# EasyEDA Pro project 新Exlink多功能调试器.epro, board 功率控制板
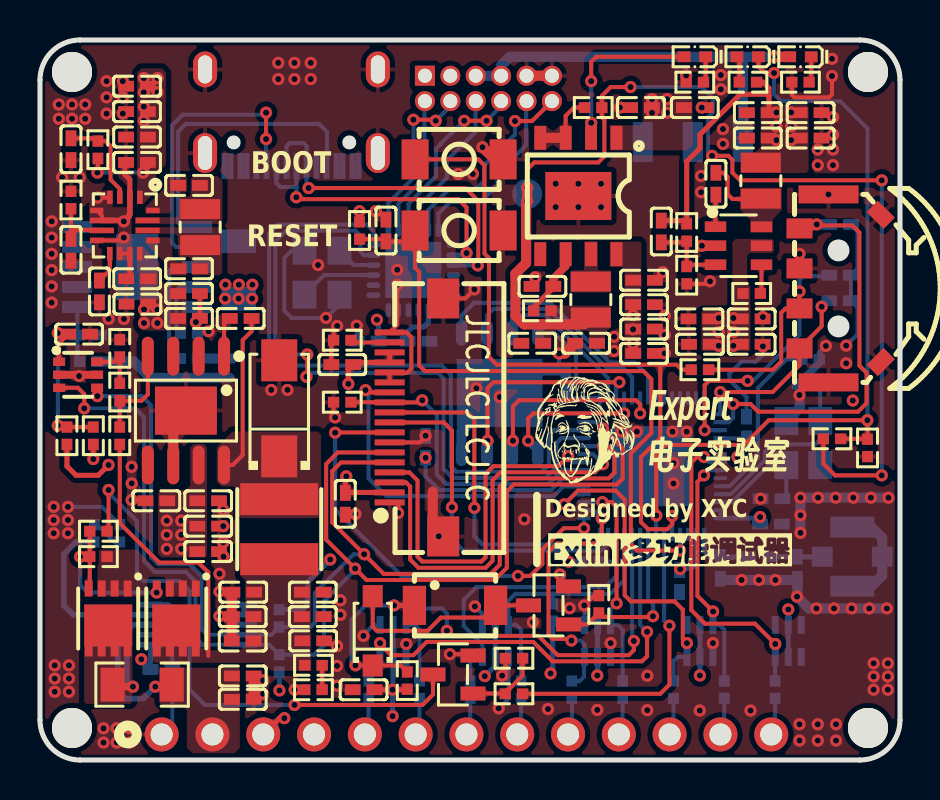
[diagram p6: board, top side]
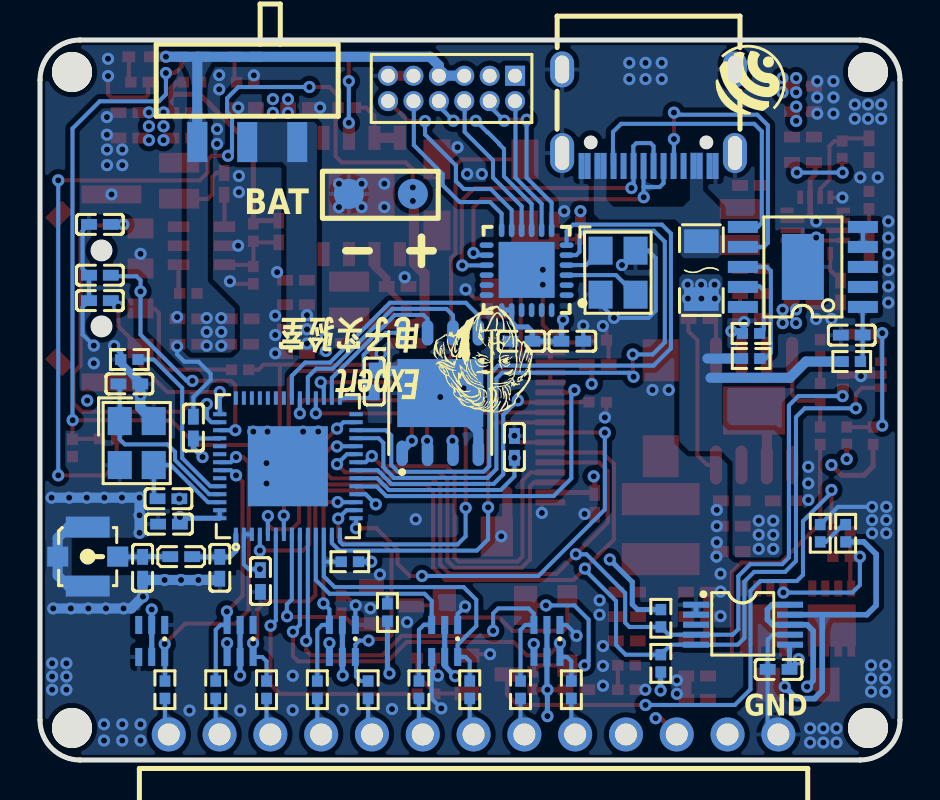
[diagram p7: board, bottom side, seen from below]

Outline 43 x 36 mm; copper layers: Top Layer, Inner1, Inner2, Bottom Layer. Coordinates in mm from the lower left corner of the outline.
Outline path: 0,34 0,2 arc(0.59,0.59) 2,0 41,0 arc(42.41,0.59) 43,2 43,34 arc(42.41,35.41) 41,36 2,36 arc(0.59,35.41) 0,34
Stack: Top Layer 0.035mm 外层铜厚1oz / Dielectric1 0.2104mm 7628 RC49% 8.6mil / Inner1 0.0152mm 内层铜厚 / Dielectric2 1.065mm 1.1mm H/HOZ Copper / Inner2 0.0152mm 内层铜厚 / Dielectric3 0.2104mm 7628 RC49% 8.6mil / Bottom Layer 0.035mm 外层铜厚1oz

## Design rules (mm)
template: 自定义配置
spacing copperThickness1oz (default): track to track 0.102, other pairs 0.152 to 0.175
spacing copperThickness2oz: track to track 0.203, other pairs 0.152 to 0.3
track width copperThickness1oz (default): min 0.127, default 0.203, max 2.54
track width power: min 0.203, default 0.254, max 2.54
differential pair differentialPair (default): width min 0.127, default 0.254, max 2.54; gap min 0.152, default 0.152
via viaSize (default): diameter min 0.5, default 0.61, max 10; hole min 0.3, default 0.305, max 6.299
net +5V uses power
net 3V3 uses power

## Placement (name value [footprint] x y rotation side)
BUZZER1  DET402  [BUZ-SMD_L4.0-W3.0-LS4.5-FD]  20.75 7.73 0 top
C1  1UF  [C0402]  17.3 26.47 270 top
C3  9PF  [C0402]  37.87 9.61 270 bottom
C4  9PF  [C0402]  34.01 9.61 270 bottom
C5  18pF  [C0402]  38.53 18.8 0 bottom
C6  18pF  [C0402]  36.58 13.06 180 bottom
C7  10uf  [C0402]  35.59 22.06 180 top
C8  100nF  [C0402]  31.98 8.95 270 bottom
C9  10uf  [C0402]  35.89 32.37 0 top
C10  100nF  [C0402]  36.55 11.79 180 bottom
C11  100nF  [C0402]  19.28 15.66 90 bottom
C12  100nF  [C0402]  35.33 16.62 90 bottom
C16  10UF  [C0402]  10.14 3.03 0 top
C17  10UF  [C0402]  10.14 4.2 0 top
C18  22uf  [C0402]  4.85 29.88 0 top
C19  10uf  [C0402]  4.85 31.15 0 top
C20  10uf  [C0402]  4.85 32.42 0 top
C21  10uf  [C0402]  4.85 33.69 0 top
C22  22nf  [C0402]  1.55 30.54 90 top
C23  1uf  [C0402]  2.97 23.43 90 top
C24  22nf  [C0402]  1.55 25.51 90 top
C25  10uf  [C0402]  4.86 24.06 180 top
C26  10uf  [C0402]  4.87 22.79 180 top
C27  10uf  [C0402]  7.45 23.32 0 top
C31  100nf  [C0402]  7.45 28.73 180 top
C32  100nf  [C0402]  7.45 24.56 180 top
C52  100nF  [C0402]  15.27 12.81 270 top
C53  100nF  [C0402]  15.11 19.77 0 top
C60  0.1UF  [C0402]  6.07 4.53 0 bottom
C65  100nF  [C0402]  18.92 20.94 0 bottom
C66  10uF  [C0402]  16.38 20.94 180 bottom
C69  10nF  [C0402]  10.03 22.08 0 top
C70  10uf  [C0402]  8.41 10.42 180 top
C75  100nF  [C0402]  10.13 7.17 0 top
C76  0.1uf  [C0402]  33.8 28.81 270 top
C77  47pf  [C0402]  31.06 26.42 90 top
C79  22uf  [C0402]  27.31 20.84 0 top
C80  10uf  [C0402]  8.41 11.69 180 top
C81  22uf  [C0402]  8.41 12.96 180 top
C82  10uf  [C0402]  10.16 8.39 0 top
C83  10uf  [C0402]  13.64 8.39 180 top
C87  22uf  [C0402]  25.12 23.68 0 top
C88  10uf  [C0402]  30.05 32.62 180 top
C89  22uf  [C0402]  32.74 32.62 0 top
C90  22uf  [C0402]  30.2 22.77 0 top
C91  22uf  [C0402]  30.2 23.99 0 top
C92  22uf  [C0402]  30.2 21.55 0 top
C94  10uf  [C0402]  2.41 21.24 0 bottom
C95  22uf  [C0402]  35.59 20.79 180 top
C96  10uf  [C0402]  35.89 31.1 0 top
C97  10uf  [C0402]  38.53 31.1 180 top
C98  22uf  [C0402]  10.13 5.95 0 top
C99  10uf  [C0402]  13.64 7.17 180 top
C100  22uf  [C0402]  13.66 5.96 180 top
C101  100nF  [C0402]  26.29 18.92 270 bottom
C102  22uf  [C0402]  38.53 32.37 180 top
C103  10uf  [C0402]  32.97 22.06 0 top
C104  10uf  [C0402]  32.99 20.79 0 top
C105  0.1uf  [C0402]  1.96 21.29 0 top
C106  22uf  [C0402]  7.45 22.08 0 top
C107  10uf  [C0402]  30.2 20.33 0 top
C108  22uf  [C0402]  5.82 12.96 0 top
C109  100nF  [C0402]  40 24.24 0 bottom
C110  100nF  [C0402]  40 26.78 0 bottom
C111  100nF  [C0402]  40 22.97 0 bottom
C112  100nF  [C0402]  16.18 3.51 180 top
C113  10uf  [C0402]  24.61 20.84 0 top
D1  1N4148W  [SOD-123F_L2.7-W1.6-LS3.8-RD]  16.64 6.46 90 top
H1  KH-2.54PH90-1X13P-L13.8  [HDR-TH_13P-P2.54-H-M-W10.4-N]  21.32 1.28 180 bottom
H2  DW127R-22-12-23  [HDR-TH_12P-P1.27-V-M-R2-C6-S1.27-1]  22.42 33.58 0 bottom
L1  15uH  [IND-SMD_L4.0-W4.0_FNR40XXS]  11.96 11.54 270 top
L4  1500R  [L0402]  35.94 10.17 180 bottom
LED3  -  [LED_0402]  35.38 35.16 180 top
LED7  -  [LED_0402]  32.74 35.16 180 top
LED8  -  [LED_0402]  38.02 35.16 180 top
NOREF  -  [Pad_e40]  1.6 34.4 0 top
NOREF#2  -  [Pad_e42]  41.4 1.6 0 top
NOREF#3  -  [Pad_e43]  41.4 34.4 0 top
NOREF#4  -  [Pad_e41]  1.6 1.6 0 top
R1  100K  [R0402]  38.53 20.02 0 bottom
R2  10K  [R0402]  15.98 26.47 90 top
R3  1M  [R0402]  13.67 4.73 180 top
R4  1M  [R0402]  13.67 3.51 0 top
R5  10K  [R0402]  2.92 10.17 180 top
R6  220R  [R0402]  2.92 11.44 0 top
R8  1M  [R0402]  2.72 11.34 270 bottom
R9  1M  [R0402]  3.99 11.34 270 bottom
R10  499K  [R0402]  2.89 30.52 90 top
R11  21.5k  [R0402]  1.55 28 270 top
R15  100K  [R0402]  35.59 23.33 180 top
R16  100K  [R0402]  32.33 26.37 90 top
R17  22.1k  [R0402]  32.33 24.24 90 top
R28  0.05  [R1206]  5.1 3.77 0 top
R29  10  [R0402]  15.11 20.99 0 top
R36  2K  [R0402]  35.4 33.89 180 top
R45  1K  [R0402]  27.66 32.62 0 top
R46  2K  [R0402]  32.74 33.89 180 top
R49  33Ω  [R0402]  16.43 3.51 270 bottom
R50  33Ω  [R0402]  18.97 3.51 270 bottom
R51  33Ω  [R0402]  21.51 3.51 270 bottom
R52  33Ω  [R0402]  24.05 3.51 270 bottom
R53  33Ω  [R0402]  26.59 3.51 270 bottom
R54  33Ω  [R0402]  29.13 3.51 270 bottom
R55  33Ω  [R0402]  31.67 3.51 270 bottom
R56  33Ω  [R0402]  34.21 3.51 270 bottom
R57  33Ω  [R0402]  36.75 3.51 270 bottom
R79  10K  [R0402]  3.99 16.21 90 top
R80  NC  [R0402]  3.99 20.58 90 top
R81  0.5  [R0402]  25.12 22.46 0 top
R85  10K  [R0402]  7.44 20.07 0 bottom
R86  24K  [R0402]  7.45 21.33 0 bottom
R87  1K  [R0402]  2.41 19.92 180 bottom
R88  10K  [R0402]  27.94 7.78 270 top
R89  5K  [R0402]  38.02 33.89 180 top
R90  0  [R0402]  15.11 17.89 180 top
R94  4.7K  [R0402]  11.96 7.09 90 bottom
R95  4.7K  [R0402]  11.96 4.83 270 bottom
R96  4.7K  [R0402]  25.63 7.37 270 bottom
R97  4.7K  [R0402]  27.51 9.91 180 bottom
R101  50  [R0402]  23.7 3.31 0 top
R102  10K  [R0402]  23.7 5.09 180 top
R103  0  [R0402]  3.99 18.4 90 top
R104  0  [R0402]  18.36 3.97 270 top
R105  0  [R0402]  2.67 16.21 90 top
R106  NC  [R0402]  1.35 16.21 90 top
R107  0  [R0402]  32.99 19.52 0 top
R108  20K  [R0402]  41.38 15.6 90 top
R109  20K  [R0402]  39.6 16.06 180 top
SW1  TM-2024A  [SW-SMD_TM-2024A]  40 23.58 270 top
SW3  SK-3245S-L1-A  [SW-SMD_SK-3245S-L1-A-1]  32.64 30.89 180 bottom
U1  ESP32-S3R8  [QFN-56_L7.0-W7.0-P0.40-TL-EP4.0]  30.61 14.69 90 bottom
U2  MP28167GQ-A  [QFN-16_L3.0-W3.0-P0.50_MP28167GQ-Z]  4.24 26.73 180 top
U4  SY8120B  [SOT-23-6_L2.9-W1.6-P0.95-LS2.8-BL]  34.93 25.71 270 top
U8  INA226AIDGST  [VSSOP-10_L3.0-W3.0-P0.50-LS4.9-BL]  7.85 6.77 270 bottom
U15  40MHz  [CRYSTAL-SMD_4P-L3.2-W2.5-BL]  38.16 15.85 270 bottom
U19  4.7uh  [IND-SMD_L2.5-W2.0_YXNAQ252010-3R3M]  8.01 26.65 90 top
U27  TC-S3403-2.0-260G  [SW-SMD_L4.0-W3.0-LS5.0]  20.96 26.47 0 top
U28  TC-S3403-2.0-260G  [SW-SMD_L4.0-W3.0-LS5.0]  20.96 30.03 180 top
U29  CH334F  [QFN-24_L4.0-W4.0-P0.50-BL-EP2.8]  18.67 24.49 90 bottom
U31  W25Q128JVPIQ  [WSON-8_L6.0-W5.0-P1.27-BL-EP]  22.99 18.35 180 bottom
U32  CH224K  [ESSOP-10_L4.9-W3.9-P1.0-LS6.0-TL-EP]  4.86 24.65 90 bottom
U51  TPS5450QDDARQ1  [SOIC-8_L4.9-W3.9-P1.27-LS6.0-BL-EP]  7.3 17.47 180 top
U52  SS54  [SMA_L4.2-W2.6-LS5.1-RD]  11.96 17.58 90 top
U53  4.7uh  [IND-SMD_L2.5-W2.0_YXNAQ252010-3R3M]  36.04 28.96 270 top
U66  1uh  [IND-SMD_L2.5-W2.0_YXNAQ252010-3R3M]  27.54 23.02 90 top
U68  IP5306  [ESOP-8_L4.9-W3.9-P1.27-LS6.0-BL-EP]  26.92 28.2 180 top
U69  MCP4017T-103E/LT  [SC-70-6_L2.2-W1.3-P0.65-LS2.1-BR]  1.91 19.26 180 top
U71  BAV99S  [SOT-363-6_L2.0-W1.3-P0.65-LS2.1-BL]  17.65 5.95 0 bottom
U82  JK-nSMD005/60V  [F1206]  9.93 24.49 270 bottom
U83  BAV99S  [SOT-363-6_L2.0-W1.3-P0.65-LS2.1-BL]  22.77 5.95 0 bottom
U84  BAV99S  [SOT-363-6_L2.0-W1.3-P0.65-LS2.1-BL]  27.88 5.95 0 bottom
U85  BAV99S  [SOT-363-6_L2.0-W1.3-P0.65-LS2.1-BL]  32.99 5.95 0 bottom
U86  BAV99S  [SOT-363-6_L2.0-W1.3-P0.65-LS2.1-BL]  37.41 5.95 0 bottom
U87  AO3400  [SOT-23-3_L2.9-W1.3-P1.90-LS2.4-BL-2]  20.65 4.28 90 top
U88  AO3400  [SOT-23-3_L2.9-W1.3-P1.90-LS2.4-BL-2]  25.43 7.73 90 top
U89  -  [电池接口]  24.36 28.3 0 bottom
U90  AON7403  [DFN-8_L3.0-W3.0-P0.65-BL]  6.81 7.07 180 top
U91  AON7403  [DFN-8_L3.0-W3.0-P0.65-BL]  3.41 7.07 180 top
U92  IPEX天线座  [IPEX-SMD_HC-RF-IPEX0303-01]  40.61 10.17 90 bottom
USB1  KH-TYPE-C-16P  [USB-C-SMD_KH-TYPE-C-16P]  12.57 32.11 0 bottom
X2  AFC01-S18FCA-00  [FPC-SMD_18P-P0.50_JS_AFC01-S18FCA-00]  18.82 17.13 90 top
X3  12MHz  [OSC-SMD_4P-L3.2-W2.5-BL]  14.1 24.37 270 bottom

## Footprints (pads in the part's own frame, mm; a bottom-side part is the same pattern mirrored in y, then rotated)
BUZ-SMD_L4.0-W3.0-LS4.5-FD
  rect 1.16x1.96 smd: 1(-2.03,0) 2(2.03,0)
C0402
  rect 0.79x0.54 smd: 1(-0.545,0) 2(0.545,0)
CRYSTAL-SMD_4P-L3.2-W2.5-BL
  rect 1.4x1.2 smd: 1(-1.1,-0.85) 2(1.1,-0.85) 3(1.1,0.85) 4(-1.1,0.85)
DFN-8_L3.0-W3.0-P0.65-BL
  rect 0.4x0.8 smd: 1(-0.975,-1.5) 2(-0.325,-1.5) 3(0.325,-1.5) 4(0.975,-1.5) 5(0.975,1.5) 6(0.325,1.5) 7(-0.325,1.5) 8(-0.975,1.5)
  rect 2.4x2.1 smd: 9(0,0.35)
ESOP-8_L4.9-W3.9-P1.27-LS6.0-BL-EP
  rect 0.6x1.2 smd: 1(-1.905,-2.909) 2(-0.635,-2.909) 3(0.635,-2.909) 4(1.905,-2.909) 5(1.905,2.909) 6(0.635,2.909) 7(-0.635,2.909) 8(-1.905,2.909)
  rect 3.3x2.4 smd: 9(0,0)
ESSOP-10_L4.9-W3.9-P1.0-LS6.0-TL-EP
  rect 0.6x1.5 smd: 1(-2,-3) 2(-1,-3) 3(0,-3) 4(1,-3) 5(2,-3) 6(2,3) 7(1,3) 8(0,3) 9(-1,3) 10(-2,3)
  rect 3.3x2.1 smd: 11(0,0)
F1206
  rect 1.19x1.728 smd: 1(-1.445,0) 2(1.445,0)
FPC-SMD_18P-P0.50_JS_AFC01-S18FCA-00
  rect 0.3x1.5 smd: 1(-4.25,1.339) 2(-3.751,1.339) 3(-3.25,1.339) 4(-2.749,1.339) 5(-2.249,1.339) 6(-1.749,1.339) 7(-1.248,1.339) 8(-0.75,1.339) 9(-0.251,1.339) 10(0.25,1.339) 11(0.75,1.339) 12(1.251,1.339) 13(1.751,1.339) 14(2.251,1.339) 15(2.751,1.339) 16(3.25,1.339) 17(3.75,1.339) 18(4.25,1.339)
  rect 2x1.6 smd: 19(5.949,-1.339) 20(-5.949,-1.339)
HDR-TH_12P-P1.27-V-M-R2-C6-S1.27-1
  rect 1x1 hole 0.7: 1(-3.175,-0.635)
  round 1 hole 0.7: 2(-3.175,0.635) 3(-1.905,-0.635) 4(-1.905,0.635) 5(-0.635,-0.635) 6(-0.635,0.635) 7(0.635,-0.635) 8(0.635,0.635) 9(1.905,-0.635) 10(1.905,0.635) 11(3.175,-0.635) 12(3.175,0.635)
HDR-TH_13P-P2.54-H-M-W10.4-N
  round 1.7 hole 1.1: 1(-15.24,0) 2(-12.7,0) 3(-10.16,0) 4(-7.62,0) 5(-5.08,0) 6(-2.54,0) 7(0,0) 8(2.54,0) 9(5.08,0) 10(7.62,0) 11(10.16,0) 12(12.7,0) 13(15.24,0)
IND-SMD_L2.5-W2.0_YXNAQ252010-3R3M
  rect 1x2 smd: 1(0.9,0) 2(-0.9,0)
IND-SMD_L4.0-W4.0_FNR40XXS
  rect 1.6x3.9 smd: 1(-1.5,0) 2(1.5,0)
IPEX-SMD_HC-RF-IPEX0303-01
  rect 1x1.05 smd: 1(0,-1.5) 4(0,1.5)
  rect 1.05x2.2 smd: 2(1.475,0) 3(-1.475,0)
L0402
  rect 0.79x0.54 smd: 1(-0.545,0) 2(0.545,0)
LED_0402
  rect 0.637x0.541 smd: 1(-0.538,0) 2(0.538,0)
OSC-SMD_4P-L3.2-W2.5-BL
  rect 1.4x1.2 smd: 1(-1.1,-0.875) 2(1.1,-0.875) 3(1.1,0.875) 4(-1.1,0.875)
Pad_e40
  round 2 hole 2: 58(0,0)
Pad_e41
  round 2 hole 2: 58(0,0)
Pad_e42
  round 2 hole 2: 58(0,0)
Pad_e43
  round 2 hole 2: 58(0,0)
QFN-16_L3.0-W3.0-P0.50_MP28167GQ-Z
  rect 0.28x0.665 smd: 1(-0.75,-1.407) 2(-0.25,-1.407) 3(0.25,-1.407) 4(0.75,-1.407) 9(0.75,1.407) 10(0.25,1.407) 11(-0.25,1.407) 12(-0.75,1.407)
  rect 0.665x0.28 smd: 5(1.407,-0.75) 8(1.407,0.75) 13(-1.407,0.75) 16(-1.407,-0.75)
  rect 1.2x0.28 smd: 6(1.14,-0.25) 7(1.14,0.25) 14(-1.14,0.25) 15(-1.14,-0.25)
QFN-24_L4.0-W4.0-P0.50-BL-EP2.8
  oval 0.28x0.7 smd: 1(-1.25,-2) 2(-0.75,-2) 3(-0.25,-2) 4(0.25,-2) 5(0.75,-2) 6(1.25,-2) 13(1.25,2) 14(0.75,2) 15(0.25,2) 16(-0.25,2) 17(-0.75,2) 18(-1.25,2)
  oval 0.7x0.28 smd: 7(2,-1.25) 8(2,-0.75) 9(2,-0.25) 10(2,0.25) 11(2,0.75) 12(2,1.25) 19(-2,1.25) 20(-2,0.75) 21(-2,0.25) 22(-2,-0.25) 23(-2,-0.75) 24(-2,-1.25)
  rect 2.8x2.8 smd: 25(0.013,0)
QFN-56_L7.0-W7.0-P0.40-TL-EP4.0
  rect 0.665x0.2 smd: 1(-3.408,2.6) 2(-3.408,2.2) 3(-3.408,1.8) 4(-3.408,1.4) 5(-3.408,1) 6(-3.408,0.6) 7(-3.408,0.2) 8(-3.408,-0.2) 9(-3.408,-0.6) 10(-3.408,-1) 11(-3.408,-1.4) 12(-3.408,-1.8) 13(-3.408,-2.2) 14(-3.408,-2.6) 29(3.408,-2.6) 30(3.408,-2.2) 31(3.408,-1.8) 32(3.408,-1.4) 33(3.408,-1) 34(3.408,-0.6) 35(3.408,-0.2) 36(3.408,0.2) 37(3.408,0.6) 38(3.408,1) 39(3.408,1.4) 40(3.408,1.8) 41(3.408,2.2) 42(3.408,2.6)
  rect 0.2x0.665 smd: 15(-2.6,-3.408) 16(-2.2,-3.408) 17(-1.8,-3.408) 18(-1.4,-3.408) 19(-1,-3.408) 20(-0.6,-3.408) 21(-0.2,-3.408) 22(0.2,-3.408) 23(0.6,-3.408) 24(1,-3.408) 25(1.4,-3.408) 26(1.8,-3.408) 27(2.2,-3.408) 28(2.6,-3.408) 43(2.6,3.408) 44(2.2,3.408) 45(1.8,3.408) 46(1.4,3.408) 47(1,3.408) 48(0.6,3.408) 49(0.2,3.408) 50(-0.2,3.408) 51(-0.6,3.408) 52(-1,3.408) 53(-1.4,3.408) 54(-1.8,3.408) 55(-2.2,3.408) 56(-2.6,3.408)
  rect 4x4 smd: 57(0,0)
R0402
  rect 0.566x0.54 smd: 1(-0.433,0) 2(0.433,0)
R1206
  rect 1.208x1.701 smd: 1(-1.479,0) 2(1.479,0)
SC-70-6_L2.2-W1.3-P0.65-LS2.1-BR
  rect 0.6x0.42 smd: 1(0.95,-0.65) 2(0.95,0) 3(0.95,0.65) 4(-0.95,0.65) 5(-0.95,0) 6(-0.95,-0.65)
SMA_L4.2-W2.6-LS5.1-RD
  rect 2.1x1.8 smd: 1(-2.4,0) 2(2.4,0)
SOD-123F_L2.7-W1.6-LS3.8-RD
  rect 1.1x1 smd: 1(-1.735,0) 2(1.735,0)
SOIC-8_L4.9-W3.9-P1.27-LS6.0-BL-EP
  oval 0.602x1.941 smd: 1(-1.905,-2.72) 2(-0.635,-2.72) 3(0.635,-2.72) 4(1.905,-2.72) 5(1.905,2.72) 6(0.635,2.72) 7(-0.635,2.72) 8(-1.905,2.72)
  rect 3.098x2.41 smd: 9(0,0)
SOT-23-3_L2.9-W1.3-P1.90-LS2.4-BL-2
  rect 0.7x1.25 smd: 1(-0.95,-1) 2(0.95,-1) 3(0,1)
SOT-23-6_L2.9-W1.6-P0.95-LS2.8-BL
  rect 0.532x1.072 smd: 1(-0.95,-1.149) 2(0,-1.149) 3(0.95,-1.149) 4(0.95,1.149) 5(0,1.149) 6(-0.95,1.149)
SOT-363-6_L2.0-W1.3-P0.65-LS2.1-BL
  rect 0.35x0.9 smd: 1(-0.65,-0.8) 2(0,-0.8) 3(0.65,-0.8) 4(0.65,0.8) 5(0,0.8) 6(-0.65,0.8)
SW-SMD_L4.0-W3.0-LS5.0
  rect 1.35x2 smd: 1(-2.2,0) 2(2.2,0)
SW-SMD_SK-3245S-L1-A-1
  rect 1x2 smd: 1(-2.5,0) 2(0,0) 3(2.5,0)
SW-SMD_TM-2024A
  rect 1x1.3 smd: 1(-3,-2.03) 2(3,-2.03) 3(-1,-2.03) 4(1,-2.03)
  rect 0.9x3 smd: 5(-4.7,-0.58) 6(4.7,-0.58)
  rect 1.2x0.8 smd rot 45: 7(-3.68,2.03)
  rect 1.2x0.8 smd rot 135: 8(3.68,2.03)
USB-C-SMD_KH-TYPE-C-16P
  oval 1.2x2 hole 0.7x1.7: 1(-4.32,1.765) 2(4.32,1.765)
  oval 1.2x1.8 hole 0.7x1.4: 3(-4.32,-2.415) 4(4.32,-2.415)
  rect 0.3x1.3 smd: A1(-3.35,2.415) A4(-2.55,2.415) A5(-1.25,2.415) A6(-0.25,2.415) A7(0.25,2.415) A8(1.25,2.415) A9(2.55,2.415) A12(3.35,2.415) B1(3.05,2.415) B4(2.25,2.415) B5(1.75,2.415) B6(0.75,2.415) B7(-0.75,2.415) B8(-1.75,2.415) B9(-2.25,2.415) B12(-3.05,2.415)
VSSOP-10_L3.0-W3.0-P0.50-LS4.9-BL
  rect 0.3x1.3 smd: 1(-1,-2.35) 2(-0.5,-2.35) 3(0,-2.35) 4(0.5,-2.35) 5(1,-2.35) 6(1,2.35) 7(0.5,2.35) 8(0,2.35) 9(-0.5,2.35) 10(-1,2.35)
WSON-8_L6.0-W5.0-P1.27-BL-EP
  oval 0.581x1.276 smd: 1(-1.905,-3.013) 2(-0.635,-3.013) 3(0.635,-3.013) 4(1.905,-3.013) 5(1.905,3.013) 6(0.635,3.013) 7(-0.635,3.013) 8(-1.905,3.013)
  rect 4.3x3.4 smd: 9(0,0)
电池接口
  round 1.5 smd: 1(0,0) 2(3.2,0)

## Nets
As in the schematic.

Pads without a net: NOREF 58; NOREF#2 58; NOREF#3 58; NOREF#4 58; U1 28 36 37 38 39 40 41 42 47 48 51; U8 3; U29 1 2 13 16 17 18 21 22 23 24; U32 2 3 10; U51 2 3 5; U68 5; U86 3; USB1 A8 B8

## Via types
v1: diameter 0.61, hole 0.305, Top Layer to Bottom Layer, 333 vias

## Routing (per net, layer and track width the routed paths; a pad name or vN(x,y) marks a point on that pad's centre or on a via; arc(x,y) is an arc through that point)
3V3: length 72.6
  Top Layer w0.254: 36.45,33.17 36.45,33.59 36.14,33.89 R36.1 ; 36.45,33.17 36.33,33.28 35.01,33.28 32.99,31.27 32.99,30.59 32.33,29.93 R16.2 32.17,26.97 C77.2 ; 36.45,33.17 36.45,32.38 C9.2 ; C112.1 v1(17.63,3.51) 18.34,3.51 R104.2 ; H1.11 11.97,2.09 v1(12.22,2.09) ; R105.1 v1(2.67,15.05) ; R2.2 v1(15.98,27.44) ; v1(15.32,14.18) 15.27,14.13 C52.1 15.29,13.38 X2.2 ; v1(15.42,18.8) 15.42,19.53 C53.2 15.77,19.88 X2.15 X2.16
  Inner1 w0.508: H2.1 H2.3
  Bottom Layer w0.203: C12.1 34.03,16.08 U1.46 ; v1(19.28,15.11) 19.28,14.18 19.96,13.5 25.55,13.5 26.14,14.09 U1.20 ; U1.3 U1.2 32.81,9.78 32.57,9.55 v1(32.01,9.55) ; U1.56 U1.55
  Bottom Layer w0.254: v1(22.24,4.19) 22.25,4.19 22.77,4.71 U83.5 U83.2 ; 11.96,7.52 13.12,7.52 13.39,7.78 13.39,8.9 14.55,10.07 ; v1(16.85,22.01) 16.93,21.93 C66.1 C65.1 18.38,21.41 18.62,21.65 19.18,21.65 19.42,21.89 U29.20 U29.19 ; U86.5 U86.2 v1(37.41,7.53) ; R97.2 v1(26.44,9.91) ; v1(25.53,4.33) 25.63,4.43 R96.2 ; R95.2 11.97,4.39 v1(11.97,3.48) ; v1(32.99,4.22) U85.5 U85.2 ; C8.1 32.01,9.52 v1(32.01,9.55) ; C12.1 35.33,15.6 v1(34.87,15.15) ; v1(36.01,12.15) C10.2 35.71,12.09 U1.56 ; v1(17.63,2.19) v1(17.63,3.51) 17.65,3.54 U71.5 U71.2 ; v1(27.86,4.22) 27.88,4.24 U84.5 U84.2 ; U8.6 5.53,5.74 C60.1 5.05,5 5.05,5.04
  vias: v1(5.07,5.04) v1(14.51,10.02) v1(36.82,32.38) v1(36.82,31.69) v1(36.82,30.99) v1(37.55,32.38) v1(37.55,31.69) v1(37.55,30.99) v1(40.64,17.97)
+5V: length 74.6
  Top Layer w0.254: v1(3.43,14.75) 2.91,14.23 1.8,14.23 1.35,14.69 1.35,15.78
  Top Layer w0.508: v1(36.7,35.16) LED8.2
  Inner1 w0.254: 13.67,15.45 4.12,15.45 v1(3.43,14.75)
  Inner1 w0.762: H1.10 13.67,1.31 13.67,18.33 15.83,20.48 24.92,20.48 27.71,23.27 32.76,23.27 v1(33.94,22.1)
  Bottom Layer w0.508: SW3.1 35.14,35.15 35.13,35.16 ; 35.13,35.16 23.5,35.16 23.06,34.72 23.06,34.21 H2.5 ; 35.13,35.16 v1(36.7,35.16)
  vias: v1(33.94,21.4) v1(33.94,20.71) v1(34.67,22.1) v1(34.67,21.4) v1(34.67,20.71)
GND: length 129.5
  Top Layer w0.203: v1(39.6,34.2) 39.6,33.28 39.45,33.13 37.72,33.13 37.59,33.26 R89.2 ; C17.2 10.94,4.2 v1(11.16,3.98) ; U88.2 26.03,9.07 26.03,9.3 ; R88.1 27.7,8.22 v1(27.21,7.73) ; v1(8.97,7.19) 9.02,7.14 9.5,7.14 ; R46.2 v1(32.31,34.23) ; v1(8.97,8.42) 9.57,8.42 ; v1(16.79,27.44) 16.88,27.44 C1.1 ; U4.2 v1(33.1,25.71) ; v1(17.91,12.35) 17.91,12.36 17.91,12.88 ; U2.6 3.1,27.21 2.83,27.48 ; v1(21.72,23.53) 21.27,23.08 20.59,23.08 ; v1(17.86,23.77) 17.86,21.76 X2.18 18.33,21.38 18.57,21.14 18.57,19.57 18.36,19.36 17.5,19.36 X2.14 17.48,18.88 ; C87.1 24.77,23.87 v1(24.77,24.14) ; v1(4.58,13) 5.23,13 C108.1 ; v1(7.79,21.9) 7.81,21.9 C106.2 C27.2 ; v1(20.5,5.29) 21.58,5.29 U87.2 ; R102.2 23.27,4.38 v1(23.11,4.22) ; v1(14.86,21.7) 14.68,21.52 R29.1 14.57,20.88 C53.1 ; 9.61,8.38 9.62,8.37 ; 17.91,15.88 19,15.88 19.33,16.21 ; U2.4 3.48,28.12 v1(2.88,28.12) ; v1(15.77,12.3) 15.74,12.27 C52.2 ; R4.1 v1(12.73,3.51) ; SW1.3 v1(37.97,25.31) ; C88.2 v1(29,32.62) ; v1(19.94,11.18) 19.94,11.18 20.59,11.18 ; U2.10 U2.11 ; v1(11.16,3.31) 10.96,3.31 C16.2 ; R17.1 33.37,23.81 v1(33.5,23.94) ; v1(14.76,17.13) 14.68,17.2 R90.2 ; U2.8 4.05,25.98 v1(4.19,26.12)
  Top Layer w0.254: U2.2 4.49,29.02 4.24,29.27 4.24,29.81 C18.1 ; U2.11 4.49,24.24 C25.2
  Top Layer w0.28: U2.6 4.14,26.98 v1(4.19,26.93) 4.46,27.2 4.46,27.26 4.49,27.29 U2.2
  Top Layer w0.381: U69.2 U69.5
  Top Layer w0.508: 6.8,16.97 6.66,16.84 U51.6 ; C98.1 C75.1 9.59,8.36 9.62,8.39 ; 19.63,13.42 19.63,11.49 v1(19.94,11.18) ; C17.2 C16.2 ; U28.1 22.73,30.03 v1(22.12,30.64) ; v1(25.96,20.32) 26.25,20.32 C79.1 ; H2.9 H2.11
  Bottom Layer w0.203: 23.42,4.22 U83.4 ; 23.42,4.22 23.42,3.06 v1(22.94,2.58) ; 23.42,4.22 v1(23.11,4.22) ; U71.1 16.67,6.75 16.17,6.25 v1(16.17,6.21) ; C101.1 25.96,19.8 v1(25.96,20.32) ; R9.1 3.1,12.66 v1(1.4,12.66) ; v1(4.19,26.12) 4.86,25.45 U32.11 ; 13.84,24.75 13.84,24.85 X3.4 12.58,25.47 12.22,25.1 12.22,22.46 12.57,22.11 v1(14.3,22.11) 14.97,22.78 X3.2 ; v1(18.31,5.8) 18.31,5.16 U71.4 ; U8.7 6.37,6.27 6.62,6.02 C60.2 6.62,1.81 H1.13 ; U85.4 33.64,5.85 ; v1(21.74,7.68) 22.12,7.31 U83.1 ; v1(36.14,20.68) 36.14,20.28 35.78,19.91 35.07,19.91 34.47,19.31 34.47,19.01 35.33,18.14 C12.2 ; C66.2 v1(15.84,21.72) ; C110.2 40.87,26.46 40.87,24.56 C109.2 C111.2 40.87,22.65 40.87,21.28 v1(40.31,20.72) ; U84.4 v1(28.53,5.84) ; U84.1 27.23,7.73
  Bottom Layer w0.254: v1(39.29,20.7) 39.29,20.68 38.96,20.35 R1.2 ; 10.2,7.76 U8.2
  Bottom Layer w0.381: R1.2 38.96,19.85 37.97,18.86 v1(37.97,18.25)
  Bottom Layer w0.508: v1(22.99,18.15) 24.31,19.47 C101.1 ; v1(38.02,11.36) v1(38.02,12.24) v1(38.02,13.11) v1(38.9,13.11) v1(39.78,13.11) v1(40.66,13.11) v1(41.54,13.11) v1(42.42,13.11) ; U31.9 21.08,16.44 U31.4 ; U92.2 41.58,11.64 42.11,11.11 U92.4 42.11,9.23 41.58,8.69 U92.3 ; C4.2 34.07,9 v1(35.08,9) v1(35.95,9) v1(36.77,9) 37.81,9 C3.2 37.87,8.19 v1(37.85,8.17) 38.44,7.58 v1(38.82,7.58) v1(39.7,7.58) v1(40.58,7.58) v1(41.46,7.58) v1(42.34,7.58) ; U15.4 37.99,17.62 C5.1
  vias: v1(0.58,26.93) v1(0.58,26.12) v1(0.58,25.31) v1(0.58,24.49) v1(0.58,23.68) v1(0.58,22.87) v1(0.69,12.66) v1(0.69,12) v1(0.69,11.34) v1(0.74,4.73) v1(0.74,4.07) v1(0.74,3.41) v1(0.94,32.77) v1(0.94,32.06) v1(1.11,29.13) v1(1.4,12) v1(1.4,11.34) v1(1.45,4.73) v1(1.45,4.07) v1(1.45,3.41) v1(1.6,32.77) v1(1.6,32.06) v1(1.96,19.19) v1(1.99,29.13) v1(2.26,32.77) v1(2.26,32.06) v1(3.18,1.58) v1(3.18,0.87) v1(3.33,33.94) v1(3.33,33.13) v1(3.33,32.32) v1(3.43,22.06) v1(3.84,1.58) v1(3.84,0.87) v1(4.14,33.94) v1(4.14,33.13) v1(4.14,32.32) v1(4.2,22.05) v1(4.49,1.58) v1(4.49,0.87) v1(4.58,14.66) v1(4.58,13.83) v1(8.43,21.44) v1(8.97,9.31) v1(9.16,12.5) v1(9.16,11.69) v1(9.16,10.88) v1(9.18,10.17) v1(11.56,18.5) v1(11.91,34.86) v1(11.91,34.04) v1(12.38,18.5) v1(12.72,34.86) v1(12.72,34.04) v1(13.54,34.86) v1(13.54,34.04) v1(13.9,24.75) v1(14.85,5.7) v1(14.85,4.71) v1(14.85,3.71) v1(15.02,7.98) v1(15.02,7.26) v1(17.86,24.51) v1(19.28,16.21) v1(20.91,29.3) v1(21.64,29.3) v1(21.82,18.59) v1(24.22,12.03) v1(24.65,6.89) v1(25.4,2.55) v1(25.78,28.81) v1(25.78,27.64) v1(26,9.27) v1(26.48,7.59) v1(26.92,28.81) v1(26.92,27.64) v1(27.87,2.5) v1(28.05,28.81) v1(28.05,27.64) v1(28.71,21.16) v1(28.7,20.45) v1(29.09,16.42) v1(29.84,16.42) v1(30.37,4.21) v1(30.37,2.49) v1(31.14,24.39) v1(31.24,22.22) v1(31.24,21.25) v1(31.24,20.33) v1(31.62,16.42) v1(31.68,14.84) v1(31.67,13.83) v1(32.33,16.42) v1(33.05,29.2) v1(33.05,28.39) v1(32.99,2.47) v1(33.09,32.62) v1(33.64,5.84) v1(34.04,34.25) v1(34.04,33.53) v1(34.15,31.55) v1(34.15,30.8) v1(35.53,2.47) v1(36.03,13.06) v1(36.14,22.15) v1(37.97,1.79) v1(37.97,0.97) v1(38.89,30.52) v1(38.89,29.74) v1(38.89,1.79) v1(38.89,0.97) v1(39.42,28.28) v1(39.6,35.06) v1(39.66,32.15) v1(39.66,31.26) v1(39.65,30.52) v1(39.65,29.74) v1(39.8,1.79) v1(39.8,0.97) v1(40.31,19.84) v1(41.68,4.83) v1(41.68,4.17) v1(41.68,3.51) v1(42.39,4.83) v1(42.39,4.17) v1(42.39,3.51)
VBUS: length 12.3
  Top Layer w0.203: C18.2 5.4,29.61 v1(5.16,29.37) ; v1(2.87,29.37) 2.89,29.39 R10.1
  Bottom Layer w0.203: v1(2.87,29.37) v1(5.16,29.37)
  Bottom Layer w0.508: 9.47,19.11 5.51,19.11 4.7,19.92 R87.1 ; R85.2 9.63,20.07
  vias: v1(5.19,34.1) v1(5.19,33.38) v1(5.19,32.67) v1(5.19,31.96) v1(5.88,34.1) v1(5.88,33.38) v1(6.34,11.97) v1(6.34,11.26) v1(6.34,10.55) v1(7.06,11.97) v1(7.06,11.26) v1(7.06,10.55) v1(9.27,23.77) v1(9.26,23.07) v1(9.94,23.77) v1(9.93,23.07) v1(10.62,23.77) v1(10.6,23.07)
BAT: length 56.4
  Top Layer w0.203: v1(42.09,14.23) 39.75,14.23 39.17,14.82 R109.2 ; v1(33.6,30.21) 34.42,30.21 34.62,30.01 34.62,29.37 35.01,28.98 v1(42.09,28.98) ; v1(24.36,28.63) 24.36,29.52 24.71,29.88 27.91,29.88 28.22,30.18 28.22,32.01 28.09,32.14 R45.2 28.09,33.21 28.54,33.65 v1(29.53,33.65)
  Top Layer w0.508: v1(24.36,28.63) v1(24.36,27.95) 24.31,27.9 24.31,24.85 23.77,24.32 23.77,22.21 24.19,21.79 24.23,21.79 24.24,21.79 25.14,21.79 25.14,21.79 27.21,21.79 U66.2
  Bottom Layer w0.203: v1(29.53,33.65) 33.08,33.65 33.65,33.09 33.65,32.39 33.4,32.14 33.4,30.41 v1(33.6,30.21) ; v1(42.09,28.98) v1(42.09,14.23)
BUZ: length 8.8
  Top Layer w0.203: v1(30.65,7.19) 30.61,7.15 28.14,7.15 27.94,7.35 27.37,6.78 U88.1
  Bottom Layer w0.203: U1.8 30.41,8.03 30.66,7.78 30.66,7.2 v1(30.65,7.19)
CC1: length 14.9
  Top Layer w0.203: v1(11.3,32.37) v1(11.3,31.05)
  Bottom Layer w0.203: U32.7 6.81,25.65 6.6,25.86 6.6,31.73 7.14,32.27 11.2,32.27 v1(11.3,32.37) ; USB1.A5 11.3,29.72 v1(11.3,31.05)
CC2: length 15.1
  Bottom Layer w0.203: U32.6 7.11,26.65 6.91,26.86 6.91,31.43 7.29,31.81 13.94,31.81 14.35,31.4 14.35,29.73 USB1.B5
CH549_DN: length 10.3
  Top Layer w0.203: H2.12 24.62,31.96 24.61,31.96 24.59,31.95 v1(23.75,31.95)
  Bottom Layer w0.203: v1(23.75,31.95) 23.75,31.27 22.2,29.72 22.2,28.94 21.81,28.55 20.46,28.55 19.42,27.5 U29.11
CH549_DP: length 9.2
  Bottom Layer w0.203: U29.12 19.92,27.32 20.5,27.9 22.02,27.9 22.87,28.74 22.87,29.3 24.31,30.74 24.31,32.92 H2.10
DC+5V:
  vias: v1(5.2,22.53) v1(5.2,21.85) v1(5.87,22.51) v1(5.87,21.85) v1(30.6,33.04) v1(30.6,32.36) v1(31.36,33.04) v1(31.36,32.36)
ESP32_DN: length 34.5
  Top Layer w0.203: v1(13.36,20.28) 13.36,19.2 v1(13.32,19.16)
  Bottom Layer w0.203: U1.25 26.06,16.09 25.83,15.86 25.83,14.64 25.3,14.11 20.62,14.11 20.18,14.55 20.18,19.07 19.89,19.36 13.52,19.36 v1(13.32,19.16) ; U29.5 16.19,25.24 16.03,25.41 16.03,26.22 15.78,26.46 12.31,26.46 11.76,25.91 11.76,20.89 12.37,20.28 v1(13.36,20.28)
ESP32_DP: length 34.7
  Bottom Layer w0.203: U1.26 25.7,16.49 25.44,16.22 25.44,14.75 25.1,14.41 20.82,14.41 20.54,14.69 20.54,19.27 20.09,19.72 12.32,19.72 11.46,20.58 11.46,26.32 11.9,26.77 16.34,26.77 16.67,26.44 U29.6
ESP32_RX: length 12.1
  Top Layer w0.203: v1(33.66,7.42) 32.87,8.21 32.87,13.91 v1(33.2,14.23)
  Bottom Layer w0.203: R56.1 34.21,6.51 33.97,6.75 U85.3 33.64,7.41 v1(33.66,7.42) ; v1(33.2,14.23) 33.46,14.49 U1.50
ESP32_TX: length 15.8
  Top Layer w0.203: v1(33.2,15.15) 32.84,15.15 32.57,14.87 32.57,7.5 33.25,6.82 35.75,6.82 v1(36.76,5.8)
  Bottom Layer w0.203: v1(33.2,15.15) 33.46,14.89 U1.49 ; R57.1 36.75,5.14 U86.6 v1(36.76,5.8)
ESP_RESET: length 33.9
  Top Layer w0.203: R2.1 17.19,26.04 C1.2 18.21,25.93 18.75,26.47 18.75,24.61 18.96,24.41 18.96,19.73 19.24,19.45 30.17,19.45 30.57,19.05 30.57,16.35 29.54,15.32 29.54,10.78 29.84,10.47 v1(32.01,10.47)
  Bottom Layer w0.203: U1.4 v1(32.01,10.47)
FB: length 4.8
  Top Layer w0.203: R79.2 3.99,17.97 5.08,17.97 5.39,18.28 U51.4
FLASH_SPI_CLK: length 10.7
  Bottom Layer w0.203: U31.6 22.35,22.23 22.68,22.56 25.38,22.56 28.37,19.57 29.18,19.57 29.61,19.14 U1.33
FLASH_SPI_CS0: length 7.6
  Top Layer w0.203: v1(24.41,15.96) 24.41,17.08 24.66,17.33 v1(29.21,17.33)
  Bottom Layer w0.203: U31.1 24.41,15.82 v1(24.41,15.96) ; U1.32 v1(29.21,17.33)
FLASH_SPI_D: length 13.1
  Bottom Layer w0.203: U31.5 21.08,22.23 21.71,22.86 25.51,22.86 28.5,19.87 29.74,19.87 30.41,19.21 U1.35
FLASH_SPI_HD: length 7.9
  Bottom Layer w0.203: U31.7 23.62,22.05 23.82,22.25 25.25,22.25 28.41,19.1 U1.30
FLASH_SPI_Q: length 10.2
  Top Layer w0.203: v1(23.65,15.96) 23.65,17.69 23.95,17.99 29.79,17.99 30.01,17.78 v1(30.01,17.33)
  Bottom Layer w0.203: U1.34 v1(30.01,17.33) ; U31.2 23.62,15.93 v1(23.65,15.96)
FLASH_SPI_WP: length 10.8
  Top Layer w0.203: v1(22.38,15.96) 22.38,18.6 22.66,18.89 v1(28.97,18.89)
  Bottom Layer w0.203: U1.31 28.81,18.73 v1(28.97,18.89) ; v1(22.38,15.96) 22.38,15.36 U31.3
GPIO0: length 35.1
  Top Layer w0.203: v1(31.61,12.2) 31.61,11.78 31.37,11.54 30.4,11.54 30.05,11.9 30.05,15.15 31.01,16.11 31.01,19.76 ; 31.01,19.76 22.84,19.76 22.45,20.16 22.45,25.1 22.22,25.32 22.22,29.73 21.92,30.03 18.75,30.03 ; 31.01,19.76 31.83,19.76 32.08,19.52 R107.1
  Bottom Layer w0.203: U1.5 v1(31.61,12.2)
GPIO4_OUT: length 23.1
  Top Layer w0.203: v1(30.35,6.41) 30.35,5.19 30.1,4.94 25.63,4.94 24.66,5.9 19.33,5.9 18.67,5.24 17.55,5.24 17,5.79 v1(17,5.84)
  Bottom Layer w0.203: U1.9 30.01,6.75 v1(30.35,6.41) ; 17,5.95 U71.6 16.65,5.15 16.43,4.94 R49.1
GPIO5_OUT: length 22.8
  Top Layer w0.203: v1(29.69,5.95) 29.69,5.49 29.44,5.24 25.88,5.24 24.92,6.21 20.6,6.21 v1(20.34,6.46)
  Bottom Layer w0.203: R50.1 18.97,6.51 18.73,6.75 U71.3 18.31,6.76 18.31,7.32 18.57,7.58 20.09,7.58 20.34,7.32 v1(20.34,6.46) ; U1.10 29.61,5.95
I2C_SCL: length 61.4
  Top Layer w0.203: v1(28.15,16.57) 29.13,15.59 29.13,14.07 28.84,13.77 23.69,13.77 23.34,13.43 23.34,9.61 22.73,9 16.33,9 v1(15.75,9.57) 14.31,11.02 14.31,14.8 14.89,15.38 17.91,15.38 ; v1(2.21,17.58) 2.21,18.3 1.89,18.61 U69.3
  Bottom Layer w0.203: v1(28.15,16.57) 27.83,16.89 U1.27 ; v1(2.21,17.58) 4.76,17.58 5.2,17.15 5.2,9.95 5.74,9.41 7.29,9.41 7.78,8.92 7.78,6.1 8.12,5.76 9.32,5.76 9.33,5.75 10.18,5.75 10.2,5.76 11.46,5.76 R95.1 13.71,5.26 14.2,5.75 14.2,7.95 15.75,9.51 v1(15.75,9.57)
I2C_SCL_OUT: length 16
  Bottom Layer w0.203: 28.81,9.88 28.78,9.91 R97.1 ; 28.81,9.88 28.81,9.18 28.27,8.64 21.82,8.64 21.19,8.01 21.19,6.7 22.12,5.77 U83.6 21.73,5.15 21.51,4.94 R51.1 ; 28.81,9.88 U1.12
I2C_SDA: length 55.5
  Top Layer w0.203: U69.4 2.87,18.6 v1(2.87,18.19) ; v1(28.15,15.68) 28.4,15.68 28.73,15.35 28.73,14.37 28.43,14.08 23.39,14.08 22.99,13.67 22.99,9.76 22.53,9.3 17.19,9.3 v1(16.21,10.29) 14.61,11.88 14.61,14.44 15.05,14.88 17.91,14.88
  Bottom Layer w0.203: v1(16.21,10.29) 15.68,10.29 13.74,8.35 13.74,6.87 13.53,6.65 R94.1 11.57,6.27 U8.4 8.36,6.27 8.09,6.54 8.09,9.19 7.49,9.79 5.89,9.79 5.55,10.13 5.55,17.73 5.09,18.19 v1(2.87,18.19) ; v1(28.15,15.68) 28.14,15.69 U1.24
I2C_SDA_OUT: length 13.5
  Bottom Layer w0.203: 25.67,8.31 28.52,8.31 29.21,9 U1.11 ; 25.67,8.31 25.63,8.27 25.63,7.81 ; 25.67,8.31 23.77,8.31 23.42,7.96 U83.3 23.43,6.77 23.8,6.77 24.05,6.51 R52.1
KET_LEFT: length 21
  Top Layer w0.203: v1(34.65,17.8) 35.52,17.8 35.91,17.41 40.9,17.41 41.33,17.84 41.33,19.36 40.97,19.72 40.97,26.37 40.61,26.73 38.89,26.73 v1(38.84,26.78) 38.64,26.58 SW1.1
  Bottom Layer w0.203: U1.44 34.43,16.89 34.65,17.11 v1(34.65,17.8) ; v1(38.84,26.78) C110.1
KEY_PUSH: length 21.2
  Top Layer w0.203: 33.43,19.52 36.65,19.52 37.06,19.92 37.06,22.36 37.26,22.56 37.96,22.56 SW1.4 v1(37.97,23.43) ; v1(35.38,18.96) 33.45,18.96 33.23,18.74 v1(33.23,16.49)
  Bottom Layer w0.203: v1(35.38,18.96) 35.66,18.96 37.97,21.27 v1(37.97,23.43) 37.97,23.99 38.18,24.19 39.41,24.19 C109.1 ; U1.45 v1(33.23,16.49)
KEY_RIGHT: length 9.5
  Top Layer w0.203: v1(39.08,22.66) 39.08,21.69 SW1.2 37.97,19.74 36.63,18.4 v1(34.01,18.4)
  Bottom Layer w0.203: v1(34.01,18.4) 34.01,17.29 U1.43 ; v1(39.08,22.66) 39.16,22.66 C111.1
LCD_CS: length 15.5
  Top Layer w0.203: v1(19.11,17.98) 19,17.88 17.91,17.88 17.9,17.89 R90.1
  Bottom Layer w0.203: U1.21 26.11,14.49 25.43,13.8 20.32,13.8 19.84,14.28 19.84,17.26 v1(19.11,17.98)
LCD_DC: length 17.5
  Top Layer w0.203: v1(16.28,18.49) 16.39,18.38 17.91,18.38
  Bottom Layer w0.203: v1(16.28,18.49) 16.43,18.34 16.43,14.08 17.32,13.19 25.68,13.19 26.16,13.67 27.18,13.67 U1.19
LCD_RST: length 22.7
  Top Layer w0.203: v1(14.76,16.37) 14.77,16.38 17.91,16.38 ; v1(27.2,11.59) 26.19,11.59 25.12,10.52 25.12,9.81 24.51,9.2 v1(23.9,9.2)
  Bottom Layer w0.203: v1(14.76,16.37) 14.76,12.52 18.08,9.2 v1(23.9,9.2) ; U1.15 v1(27.2,11.59)
LCD_SCL: length 16.7
  Top Layer w0.203: 17.91,17.38 21.37,17.38 21.72,17.03 v1(21.72,12.61)
  Bottom Layer w0.203: v1(21.72,12.61) 21.72,11.18 22.12,10.78 27.86,10.78 28.01,10.92 U1.14
LCD_SDA: length 16.9
  Top Layer w0.203: 17.91,16.88 20.19,16.88 20.6,16.47 20.6,13.5 20.6,13.5 20.6,13.04 20.6,13.03 v1(20.6,12.64)
  Bottom Layer w0.203: v1(20.6,12.64) 20.6,11.03 21.16,10.47 28.03,10.47 28.41,10.85 U1.13
LCD_TOUCH_INT: length 19.8
  Top Layer w0.203: 17.91,13.88 18.3,13.88 18.5,13.67 18.5,10.03 18.92,9.61 22.28,9.61 22.63,9.97 22.63,13.99 23.03,14.38 27.74,14.38 v1(28.15,14.79)
  Bottom Layer w0.203: v1(28.15,14.79) 27.65,15.29 U1.23
LCD_TOUCH_RST: length 18.1
  Top Layer w0.203: 17.91,14.38 18.47,14.38 18.88,13.97 18.88,10.16 19.12,9.92 22.07,9.92 22.28,10.13 22.28,14.31 22.66,14.69 25.9,14.69 v1(26.41,15.2)
  Bottom Layer w0.203: U1.22 26.72,14.89 v1(26.41,15.2)
LED/BAT: length 40
  Top Layer w0.203: v1(36.7,34.35) 36.29,34.35 36.22,34.42 36.18,34.42 35.92,34.67 LED3.1 ; 40.03,16.06 41.35,16.06 R108.2 41.38,16.98 v1(41.37,16.99) 36.44,16.99 35.21,15.76 31.27,15.76 30.81,15.3 v1(30.81,12.22)
  Bottom Layer w0.203: v1(36.7,34.35) 36.7,33.28 37.05,32.94 40.01,32.94 41.38,31.57 41.38,17 v1(41.37,16.99) ; v1(30.81,12.22) 30.81,12.21 U1.7
NRESET: length 16.9
  Top Layer w0.203: v1(32.34,5.84) 32.14,6.05 32.14,7.52 31.72,7.93 29.54,7.93 29.24,8.24 29.24,13.01 28.78,13.47 26.9,13.47 v1(26.21,12.78)
  Bottom Layer w0.203: R55.1 31.67,4.94 31.89,5.15 U85.6 v1(32.34,5.84) ; v1(26.21,12.78) 26.72,13.29 U1.18
PICO_DN: length 9
  Top Layer w0.203: v1(22.33,31.96) v1(21.21,31.96)
  Bottom Layer w0.203: v1(22.33,31.96) 23.06,32.69 23.06,32.94 ; v1(21.21,31.96) 20.62,31.38 20.6,31.38 20.04,30.82 20.04,30.79 19.8,30.55 19.8,29.18 18.42,27.8 U29.9
PICO_DP: length 7.6
  Bottom Layer w0.203: U29.10 18.92,27.69 20.35,29.12 20.35,29.99 21.77,31.4 21.77,32.92 H2.6
POWER_CTRL: length 15.2
  Top Layer w0.203: R101.2 31.01,3.31 31.47,3.77 v1(31.47,6.71)
  Bottom Layer w0.203: v1(31.47,6.71) 31.21,6.98 U1.6
SWCLK: length 11
  Top Layer w0.203: v1(28.12,12.9) 28.59,12.9 28.83,12.66 v1(28.83,7.83)
  Bottom Layer w0.203: v1(28.12,12.9) 28.11,12.89 U1.17 ; v1(28.83,7.83) 28.53,7.53 U84.3 28.89,6.75 29.13,6.51 R54.1
SWDIO: length 13.4
  Top Layer w0.203: v1(26.57,5.97) 26.49,6.05 25.63,6.05 25.43,6.26 25.43,10.4 25.86,10.83 27.76,10.83 28.09,11.16 v1(28.09,12.07)
  Bottom Layer w0.203: v1(26.57,5.97) 27.03,5.97 27.23,5.77 U84.6 27.2,5.12 27.2,4.17 26.98,3.95 R53.1 ; v1(28.09,12.07) 27.67,12.49 U1.16
USB_DN: length 15.2
  Top Layer w0.203: v1(21.33,25.35) 21.33,27.63 20.91,28.04 12.91,28.04 v1(12.81,28.14)
  Bottom Layer w0.203: 12.82,28.65 12.82,28.15 v1(12.81,28.14) ; 12.82,28.65 USB1.A7 ; 12.82,28.65 12.01,28.65 11.82,28.84 USB1.B7 ; v1(21.33,25.35) 21.22,25.24 U29.14
USB_DP: length 17.5
  Top Layer w0.203: v1(13.43,28.6) 21.27,28.6 21.91,27.95 21.91,24.75 v1(21.89,24.73)
  Bottom Layer w0.203: v1(21.89,24.73) 20.68,24.73 U29.15 ; USB1.A6 12.32,30.7 12.47,30.84 13.18,30.84 13.34,30.69 13.34,29.71 USB1.B6 13.32,28.71 v1(13.43,28.6)
USBA_DN: length 8.5
  Top Layer w0.203: v1(19.79,31.96) 19.74,32.01 v1(18.67,32.01)
  Bottom Layer w0.203: H2.4 20.52,32.69 v1(19.79,31.96) ; U29.7 17.42,27.87 18.67,29.12 v1(18.67,32.01)
USBA_DP: length 7
  Bottom Layer w0.203: H2.2 19.23,32.92 19.23,29.12 17.92,27.81 U29.8
VOUT: length 13.5
  Top Layer w0.203: 3.99,15.78 3.99,11.84 5.96,9.87 7.92,9.87 8.18,9.61 ; 8.41,5.21 8.41,9.38 8.22,9.58
VOUT_BUS+: length 8.2
  Top Layer w0.381: v1(4.65,3.67) 3.73,3.67 R28.1
  Bottom Layer w0.28: 6.38,6.77 6.63,7.02 6.63,7.53 6.39,7.77 U8.10 ; v1(4.65,3.67) 4.34,3.97 4.34,6.46 4.65,6.76 6.38,6.76
VOUT_BUS-: length 15.8
  Top Layer w0.381: R28.2 6.48,3.67 v1(5.77,3.67)
  Bottom Layer w0.28: 3.89,7.27 U8.9 ; 3.89,7.27 3.89,3.46 4.28,3.07 5.17,3.07 v1(5.77,3.67) ; 3.89,7.27 1.66,7.27 1.19,7.73 1.19,10.29 1.81,10.9 R8.2
VSPI: length 6.3
  Bottom Layer w0.203: U31.8 25.71,21.36 26.81,20.26 26.81,18.9 C101.2 26.57,18.1 U1.29
X40MI: length 9.2
  Bottom Layer w0.203: U1.53 34.54,13.29 36.25,14.99 36.25,15.4 36.63,15.78 38.76,15.78 39.01,16.03 U15.1 39.01,18.74 C5.2
X40MO: length 5.8
  Bottom Layer w0.203: C6.1 37.31,13.25 U15.3 36.45,14.75 34.6,12.89 U1.54
XIN: length 2
  Bottom Layer w0.203: U29.4 15.69,24.74 X3.1
XOUT: length 3.9
  Bottom Layer w0.203: X3.3 14.2,24.24 U29.3
$1N2849: length 1.6
  Top Layer w0.203: C23.2 3.49,24.49 U2.9
$1N2854: length 3.1
  Top Layer w0.203: 1.55,26.5 C24.2 ; 1.55,26.5 R11.2 ; 1.55,26.5 3.08,26.5 3.1,26.48
$1N2855: length 4.9
  Top Layer w0.203: C22.2 2.76,31.08 R10.2 3.27,30.95 3.53,30.69 3.53,29.02 3.99,28.55 U2.3
$1N3511: length 2
  Top Layer w0.203: U51.1 9.2,21.79 C69.1
$1N3513: length 8.2
  Top Layer w0.203: U51.8 9.64,14.75 10.13,15.25 10.13,20.99 10.58,21.44 C69.2
$1N4027: length 3.3
  Top Layer w0.203: C76.1 34.18,29.36 34.38,29.15 34.38,28.29 34.62,28.05 36.03,28.05 U53.1
$1N4028: length 1.6
  Top Layer w0.203: U4.1 33.78,28.25 C76.2
$1N4032: length 1.5
  Top Layer w0.203: U4.4 36.07,23.38 R15.1
$1N4033: length 4
  Top Layer w0.203: U4.3 32.42,24.76 R17.2 32.33,25.94 32.27,25.88 C77.1
$1N4911: length 3.5
  Top Layer w0.254: R81.1 24.69,22.64 25.67,23.62 C87.2
  Top Layer w0.381: C87.2 25.67,24.07 26.28,24.69 U68.6
$1N4917: length 3.5
  Top Layer w0.203: R45.1 26.69,32.62 26.28,32.21 U68.3
  Top Layer w0.508: U68.4 U68.3
$1N4920: length 1.3
  Top Layer w0.203: LED7.1 33.28,34 R46.1
$1N4922: length 8.5
  Top Layer w0.203: v1(27.56,31.86) 27.56,31.12 U68.2 ; v1(27.56,33.94) 27.56,34.91 27.81,35.16 LED7.2
  Bottom Layer w0.203: v1(27.56,31.86) v1(27.56,33.94)
$1N4926:
  vias: v1(29.65,22.24) v1(29.65,21.53) v1(29.65,20.82)
$1N5377: length 1
  Bottom Layer w0.203: U32.5 U32.4
$1N5662: length 6.2
  Bottom Layer w0.203: U32.8 6.66,24.65 6.46,24.45 6.46,20.35 6.73,20.07 R85.1
$1N5692: length 3.4
  Bottom Layer w0.203: U32.9 7.83,23.68 7.02,23.68 6.81,23.48 6.81,21.53 R86.1
$1N5786: length 2.8
  Bottom Layer w0.203: U32.1 1.87,22.64 C94.1 1.87,20.03 R87.2
$1N6471: length 1.2
  Top Layer w0.203: R3.1 R4.2
$1N6478: length 1.6
  Bottom Layer w0.203: R8.1 2.84,11.77 3.71,10.9 R9.2
$1N11240: length 1.3
  Top Layer w0.203: R89.1 38.56,34 LED8.1
$1N21252: length 3.8
  Top Layer w0.203: U87.1 23.25,3.33 R101.1 23.27,3.36 24.13,4.22 R102.1
$1N33508: length 2.5
  Top Layer w0.203: U69.6 3.75,19.91 R80.1 R103.2
$1N38664: length 8.5
  Top Layer w0.203: R105.2 R106.2 0.96,16.65 v1(0.89,16.72) ; U69.1 0.96,20.84 C105.1 1.36,21.34 v1(0.89,21.34)
  Bottom Layer w0.203: v1(0.89,21.34) v1(0.89,16.72)
$1N42364: length 28.5
  Top Layer w0.203: U87.3 19.65,3.28 19.13,2.75 v1(12.72,2.75) ; v1(3.43,13.5) 3.43,11.51 R6.2
  Bottom Layer w0.203: v1(3.43,13.5) 3.43,13.37 4.85,11.94 4.85,9.25 5.16,8.95 6.99,8.95 7.48,8.46 7.48,3.53 8.25,2.75 v1(12.72,2.75)
$1N42368: length 8.9
  Top Layer w0.203: R5.2 2.48,10.16 v1(2.01,10.16) ; R5.2 2.49,8.63 U91.4 ; R5.2 R6.1 ; 5.9,8.43 5.89,8.43 v1(5.83,8.37)
  Bottom Layer w0.203: v1(2.01,10.16) 2.01,8.75 2.38,8.37 v1(5.83,8.37)
$2N6654: length 8.8
  Bottom Layer w0.203: R1.1 37.31,20.02 35.89,18.6 35.89,15.1 34.48,13.69 U1.52
$2N6663: length 3.1
  Bottom Layer w0.254: L4.2 35.38,10.15 C4.1 33.52,10.15 33.21,10.46 U1.1
$2N6706: length 2.4
  Top Layer w0.203: 17.91,20.88 15.66,20.88 R29.2
$2N10807: length 9.9
  Top Layer w0.203: U88.3 BUZZER1.2 22.17,7.12 20.04,7.12 19.38,6.46 16.84,6.46 16.64,6.66 D1.2
$2N15195: length 1.9
  Bottom Layer w0.203: 16.43,3.08 16.43,1.47 H1.9
$2N15197: length 1.9
  Bottom Layer w0.203: H1.8 18.97,1.47 18.97,3.08 19,3.06
$2N15199: length 1.9
  Bottom Layer w0.203: 21.51,3.08 21.51,1.47 H1.7
$2N15201: length 1.9
  Bottom Layer w0.203: H1.6 24.05,1.47 24.05,3.08
$2N15203: length 1.9
  Bottom Layer w0.203: H1.5 26.59,1.47 26.59,3.08
$2N15205: length 1.9
  Bottom Layer w0.203: 29.13,3.08 29.13,1.47 H1.4
$2N15207: length 1.9
  Bottom Layer w0.203: H1.3 31.67,1.47 31.67,3.08
$2N15209: length 1.9
  Bottom Layer w0.203: 34.21,3.08 34.21,1.47 H1.2
$2N15211: length 1.9
  Bottom Layer w0.203: H1.1 36.75,1.47 36.75,3.08
$2N31679: length 1.3
  Top Layer w0.203: R36.2 34.97,35.04 LED3.2
$2N31792: length 8.5
  Top Layer w0.203: v1(15.77,4.73) 16.63,4.73 D1.1 18.04,4.72 R104.1
  Top Layer w0.254: BUZZER1.1 v1(17.7,7.73)
  Bottom Layer w0.203: v1(17.7,7.73) 16.28,7.73 15.57,7.02 15.57,4.94 v1(15.77,4.73)
$2N40023: length 2.6
  Bottom Layer w0.254: L4.1 37.86,10.17 C3.1 39.1,10.15 U92.1

## Copper pours and planes (outline as drawn; the poured copper is in the pictures)
3V3 on Top Layer: 35.04,32.76 38.43,32.76 38.43,29.35 35.04,29.35
3V3 on Inner1: -1.45,37.3 44.47,37.3 44.47,-1.31 -1.45,-1.31
+5V on Top Layer: 33.07,26.06 36.7,26.06 36.7,20.44 33.07,20.44
+5V on Bottom Layer: 33.26,31.92 35.66,31.92 35.66,20.37 33.26,20.37
+5V on Inner1: 33.27,22.77 35.32,22.77 35.32,20.23 33.27,20.23
GND on Top Layer: -1.75,37.19 44.37,37.19 44.37,-1.26 -1.75,-1.26
GND on Top Layer: 2.46,28.48 4.58,28.48 4.58,24.98 2.46,24.98
GND on Bottom Layer: 38.41,12.79 42.68,12.79 42.68,11.13 38.41,11.13
GND on Bottom Layer: -2.31,38.06 45.44,38.06 45.44,-1.97 -2.31,-1.97
GND on Bottom Layer: 41.42,11.83 42.72,11.83 42.72,8.75 41.42,8.75
GND on Bottom Layer: 38.41,9.22 42.68,9.22 42.68,7.56 38.41,7.56
GND on Inner2: -3.28,38.67 46.61,38.67 46.61,-2.58 -3.28,-2.58
VBUS on Top Layer: 5.9,15.8 8.35,15.8 8.35,10.12 5.9,10.12
VBUS on Top Layer: 4.86,34.58 6.3,34.58 6.3,27.79 4.86,27.79
VBUS on Bottom Layer: 5.89,24.27 11.03,24.27 11.03,10.13 5.89,10.13
VBUS on Bottom Layer: 8.89,24.26 10.99,24.26 10.99,22.45 8.89,22.45
VBUS on Inner1: 4.81,34.59 11.06,34.59 11.06,22.67 4.81,22.67
BAT on Top Layer: 24.74,22.73 28.54,22.73 28.54,20.55 24.74,20.55
DC+5V on Top Layer: 4.84,25.67 7.34,25.67 7.34,21.47 4.84,21.47
DC+5V on Top Layer: 28.49,33.37 32.63,33.37 32.63,30.48 28.49,30.48
DC+5V on Inner1: 4.74,33.54 32.57,33.54 32.57,19.53 4.74,19.53
USBVIN on Bottom Layer: 8.97,30.39 15.31,30.39 15.31,25.09 8.97,25.09
VOUT on Top Layer: 5.61,10.84 13.92,10.84 13.92,4.46 5.61,4.46
VOUT_BUS+ on Top Layer: 2.21,7.77 4.61,7.77 4.61,2.81 2.21,2.81
VOUT_BUS- on Top Layer: 5.98,4.61 9.99,4.61 9.99,0.33 5.98,0.33
$1N2856 on Top Layer: 5.25,29.2 7.36,29.2 7.36,27.33 5.25,27.33
$1N2857 on Top Layer: 4.75,29.19 9.12,29.19 9.12,26.8 4.75,26.8
$1N2858 on Top Layer: 4.75,26.64 9.12,26.64 9.12,24.23 4.75,24.23
$1N2859 on Top Layer: 5.26,26.13 7.38,26.13 7.38,24.23 5.26,24.23
$1N3513 on Top Layer: 8.84,16.42 14.05,16.42 14.05,12.09 8.84,12.09
$1N4027 on Top Layer: 35,28.71 37.1,28.71 37.1,26.36 35,26.36
$1N4912 on Top Layer: 26.51,25.94 28.56,25.94 28.56,23.38 26.51,23.38
$1N4926 on Top Layer: 28.48,25.92 30.08,25.92 30.08,20.04 28.48,20.04
$1N4926 on Bottom Layer: 29.16,31.89 30.69,31.89 30.69,20.49 29.16,20.49
$1N4926 on Bottom Layer: 29.16,31.89 33.14,31.89 33.14,29.68 29.16,29.68
$1N42380 on Top Layer: 2.88,10.52 7.99,10.52 7.99,8.17 2.88,8.17

Small or netless copper shapes (teardrops, artwork), in the pictures only: 310 on Top Layer, 346 on Bottom Layer, 5 on Inner1

## Text on the board
Bottom Silkscreen Layer: + | - | GND | BAT
Top Silkscreen Layer: JLCJLCJLCJLC | Designed by XYC | Exlink多功能调试器 | RESET | BOOT
